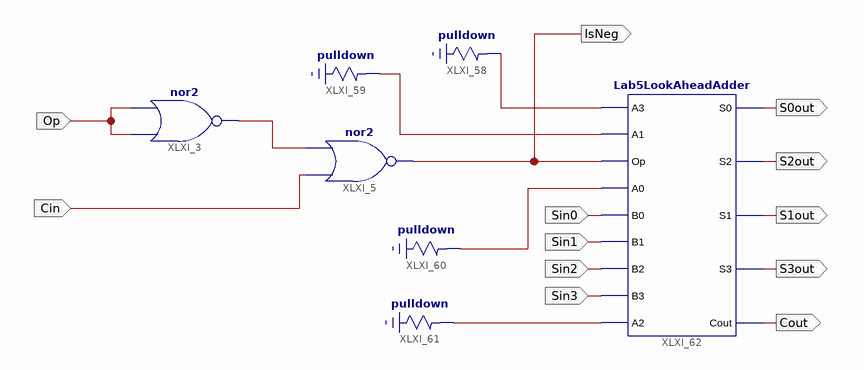
[diagram p0: schematic sheet 1]
// Xilinx ISE schematic TwosComp.sch (spartan3e) as structural Verilog: 7 symbols, 12 ports
module TwosComp (
  input  Sin0,
  input  Sin1,
  input  Sin2,
  input  Sin3,
  input  Op,
  input  Cin,
  output IsNeg,
  output S0out,
  output S2out,
  output S1out,
  output S3out,
  output Cout
);

  wire XLXN_25, XLXN_194, XLXN_196, XLXN_197, XLXN_231;

  \pulldown  XLXI_58 (.O(XLXN_194));
  \pulldown  XLXI_61 (.O(XLXN_197));
  nor XLXI_3 (XLXN_25, Op, Op);
  nor XLXI_5 (IsNeg, Cin, XLXN_25);
  \pulldown  XLXI_59 (.O(XLXN_231));
  \pulldown  XLXI_60 (.O(XLXN_196));
  Lab5LookAheadAdder XLXI_62 (
    .A3(XLXN_194), .A1(XLXN_231), .Op(IsNeg), .A0(XLXN_196), .B0(Sin0), .B1(Sin1), .B2(Sin2), .B3(Sin3),
    .A2(XLXN_197), .S0(S0out), .S2(S2out), .S1(S1out), .S3(S3out), .Cout(Cout));
endmodule
